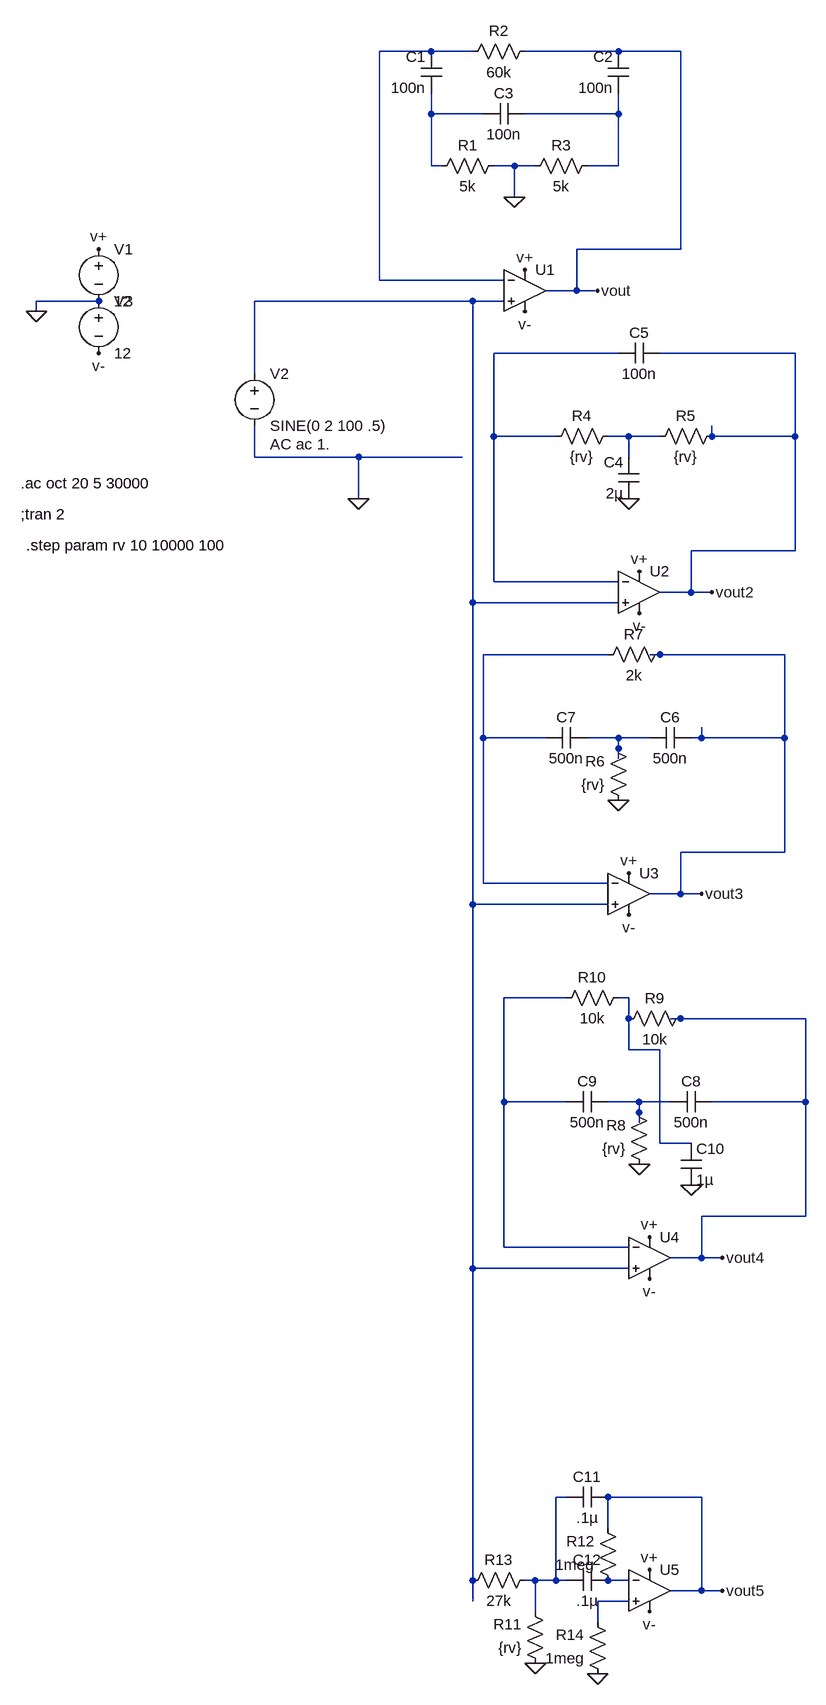
[diagram p0: schematic filter-compare.asc]
filter-compare.asc, the LTspice schematic file:
Version 4
SHEET 1 3112 2308
WIRE 560 -208 480 -208
WIRE 624 -208 560 -208
WIRE 848 -208 704 -208
WIRE 944 -208 848 -208
WIRE 560 -112 560 -144
WIRE 640 -112 560 -112
WIRE 848 -112 848 -144
WIRE 848 -112 704 -112
WIRE 560 -32 560 -112
WIRE 576 -32 560 -32
WIRE 688 -32 656 -32
WIRE 720 -32 688 -32
WIRE 848 -32 848 -112
WIRE 848 -32 800 -32
WIRE 688 16 688 -32
WIRE 944 96 944 -208
WIRE 944 96 784 96
WIRE 480 144 480 -208
WIRE 672 144 480 144
WIRE 784 160 784 96
WIRE 784 160 736 160
WIRE 816 160 784 160
WIRE 48 176 -48 176
WIRE 624 176 288 176
WIRE 672 176 624 176
WIRE -48 192 -48 176
WIRE 848 256 656 256
WIRE 1120 256 912 256
WIRE 288 288 288 176
WIRE 656 384 656 256
WIRE 752 384 656 384
WIRE 864 384 832 384
WIRE 912 384 864 384
WIRE 992 384 992 368
WIRE 1120 384 1120 256
WIRE 1120 384 992 384
WIRE 288 416 288 368
WIRE 448 416 288 416
WIRE 608 416 448 416
WIRE 864 416 864 384
WIRE 448 480 448 416
WIRE 1120 560 1120 384
WIRE 1120 560 960 560
WIRE 656 608 656 384
WIRE 848 608 656 608
WIRE 960 624 960 560
WIRE 960 624 912 624
WIRE 992 624 960 624
WIRE 624 640 624 176
WIRE 848 640 624 640
WIRE 832 720 640 720
WIRE 912 720 896 720
WIRE 1104 720 912 720
WIRE 640 848 640 720
WIRE 736 848 640 848
WIRE 848 848 800 848
WIRE 896 848 848 848
WIRE 976 848 976 832
WIRE 976 848 960 848
WIRE 1104 848 1104 720
WIRE 1104 848 976 848
WIRE 848 864 848 848
WIRE 848 880 848 864
WIRE 1104 1024 1104 848
WIRE 1104 1024 944 1024
WIRE 640 1072 640 848
WIRE 832 1072 640 1072
WIRE 944 1088 944 1024
WIRE 944 1088 896 1088
WIRE 976 1088 944 1088
WIRE 624 1104 624 640
WIRE 832 1104 624 1104
WIRE 768 1248 672 1248
WIRE 864 1248 848 1248
WIRE 864 1280 864 1248
WIRE 944 1280 928 1280
WIRE 1136 1280 944 1280
WIRE 864 1328 864 1280
WIRE 912 1328 864 1328
WIRE 672 1408 672 1248
WIRE 768 1408 672 1408
WIRE 880 1408 832 1408
WIRE 928 1408 880 1408
WIRE 1136 1408 1136 1280
WIRE 1136 1408 992 1408
WIRE 880 1424 880 1408
WIRE 880 1440 880 1424
WIRE 912 1472 912 1328
WIRE 960 1472 912 1472
WIRE 1136 1584 1136 1408
WIRE 1136 1584 976 1584
WIRE 672 1632 672 1408
WIRE 864 1632 672 1632
WIRE 976 1648 976 1584
WIRE 976 1648 928 1648
WIRE 1008 1648 976 1648
WIRE 624 1664 624 1104
WIRE 864 1664 624 1664
WIRE 768 2016 752 2016
WIRE 976 2016 832 2016
WIRE 832 2064 832 2016
WIRE 624 2144 624 1664
WIRE 720 2144 704 2144
WIRE 752 2144 752 2016
WIRE 752 2144 720 2144
WIRE 768 2144 752 2144
WIRE 864 2144 832 2144
WIRE 976 2160 976 2016
WIRE 976 2160 928 2160
WIRE 1008 2160 976 2160
WIRE 624 2176 624 2144
WIRE 864 2176 816 2176
WIRE 720 2192 720 2144
WIRE 816 2208 816 2176
FLAG 448 480 0
FLAG -48 192 0
FLAG 48 96 v+
FLAG 704 128 v+
FLAG 48 256 v-
FLAG 704 192 v-
FLAG 816 160 vout
FLAG 688 16 0
FLAG 880 592 v+
FLAG 880 656 v-
FLAG 992 624 vout2
FLAG 864 480 0
FLAG 864 1056 v+
FLAG 864 1120 v-
FLAG 976 1088 vout3
FLAG 848 944 0
FLAG 896 1616 v+
FLAG 896 1680 v-
FLAG 1008 1648 vout4
FLAG 880 1504 0
FLAG 960 1536 0
FLAG 896 2128 v+
FLAG 896 2192 v-
FLAG 1008 2160 vout5
FLAG 720 2272 0
FLAG 816 2288 0
SYMBOL voltage 48 80 R0
WINDOW 123 0 0 Left 2
WINDOW 39 0 0 Left 2
SYMATTR InstName V1
SYMATTR Value 12
SYMBOL voltage 288 272 R0
WINDOW 123 24 124 Left 2
WINDOW 39 0 0 Left 2
SYMATTR Value2 AC ac 1.
SYMATTR InstName V2
SYMATTR Value SINE(0 2 100 .5)
SYMBOL Opamps\\UniversalOpamp2 704 160 R0
SYMATTR InstName U1
SYMBOL res 672 -48 R90
WINDOW 0 0 56 VBottom 2
WINDOW 3 32 56 VTop 2
SYMATTR InstName R1
SYMATTR Value 5k
SYMBOL res 720 -224 R90
WINDOW 0 0 56 VBottom 2
WINDOW 3 32 56 VTop 2
SYMATTR InstName R2
SYMATTR Value 60k
SYMBOL cap 576 -144 R180
WINDOW 0 24 56 Left 2
WINDOW 3 24 8 Left 2
SYMATTR InstName C1
SYMATTR Value 100n
SYMBOL cap 864 -144 R180
WINDOW 0 24 56 Left 2
WINDOW 3 24 8 Left 2
SYMATTR InstName C2
SYMATTR Value 100n
SYMBOL voltage 48 160 R0
WINDOW 123 0 0 Left 2
WINDOW 39 0 0 Left 2
SYMATTR InstName V3
SYMATTR Value 12
SYMBOL res 816 -48 R90
WINDOW 0 0 56 VBottom 2
WINDOW 3 32 56 VTop 2
SYMATTR InstName R3
SYMATTR Value 5k
SYMBOL cap 704 -128 R90
WINDOW 0 0 32 VBottom 2
WINDOW 3 32 32 VTop 2
SYMATTR InstName C3
SYMATTR Value 100n
SYMBOL Opamps\\UniversalOpamp2 880 624 R0
SYMATTR InstName U2
SYMBOL res 848 368 R90
WINDOW 0 0 56 VBottom 2
WINDOW 3 32 56 VTop 2
SYMATTR InstName R4
SYMATTR Value {rv}
SYMBOL res 1008 368 R90
WINDOW 0 0 56 VBottom 2
WINDOW 3 32 56 VTop 2
SYMATTR InstName R5
SYMATTR Value {rv}
SYMBOL cap 880 480 R180
WINDOW 0 24 56 Left 2
WINDOW 3 24 8 Left 2
SYMATTR InstName C4
SYMATTR Value 2µ
SYMBOL cap 848 272 R270
WINDOW 0 32 32 VTop 2
WINDOW 3 0 32 VBottom 2
SYMATTR InstName C5
SYMATTR Value 100n
SYMBOL Opamps\\UniversalOpamp2 864 1088 R0
SYMATTR InstName U3
SYMBOL res 864 960 R180
WINDOW 0 36 76 Left 2
WINDOW 3 36 40 Left 2
SYMATTR InstName R6
SYMATTR Value {rv}
SYMBOL res 928 704 R90
WINDOW 0 0 56 VBottom 2
WINDOW 3 32 56 VTop 2
SYMATTR InstName R7
SYMATTR Value 2k
SYMBOL cap 896 864 R270
WINDOW 0 32 32 VTop 2
WINDOW 3 0 32 VBottom 2
SYMATTR InstName C6
SYMATTR Value 500n
SYMBOL cap 736 864 R270
WINDOW 0 32 32 VTop 2
WINDOW 3 0 32 VBottom 2
SYMATTR InstName C7
SYMATTR Value 500n
SYMBOL Opamps\\UniversalOpamp2 896 1648 R0
SYMATTR InstName U4
SYMBOL res 896 1520 R180
WINDOW 0 36 76 Left 2
WINDOW 3 36 40 Left 2
SYMATTR InstName R8
SYMATTR Value {rv}
SYMBOL res 960 1264 R90
WINDOW 0 0 56 VBottom 2
WINDOW 3 32 56 VTop 2
SYMATTR InstName R9
SYMATTR Value 10k
SYMBOL cap 928 1424 R270
WINDOW 0 32 32 VTop 2
WINDOW 3 0 32 VBottom 2
SYMATTR InstName C8
SYMATTR Value 500n
SYMBOL cap 768 1424 R270
WINDOW 0 32 32 VTop 2
WINDOW 3 0 32 VBottom 2
SYMATTR InstName C9
SYMATTR Value 500n
SYMBOL res 864 1232 R90
WINDOW 0 0 56 VBottom 2
WINDOW 3 32 56 VTop 2
SYMATTR InstName R10
SYMATTR Value 10k
SYMBOL cap 944 1472 R0
SYMATTR InstName C10
SYMATTR Value 1µ
SYMBOL Opamps\\UniversalOpamp2 896 2160 R0
SYMATTR InstName U5
SYMBOL res 736 2288 R180
WINDOW 0 36 76 Left 2
WINDOW 3 36 40 Left 2
SYMATTR InstName R11
SYMATTR Value {rv}
SYMBOL res 848 2160 R180
WINDOW 0 36 76 Left 2
WINDOW 3 36 40 Left 2
SYMATTR InstName R12
SYMATTR Value 1meg
SYMBOL cap 768 2032 R270
WINDOW 0 32 32 VTop 2
WINDOW 3 0 32 VBottom 2
SYMATTR InstName C11
SYMATTR Value .1µ
SYMBOL cap 768 2160 R270
WINDOW 0 32 32 VTop 2
WINDOW 3 0 32 VBottom 2
SYMATTR InstName C12
SYMATTR Value .1µ
SYMBOL res 720 2128 R90
WINDOW 0 0 56 VBottom 2
WINDOW 3 32 56 VTop 2
SYMATTR InstName R13
SYMATTR Value 27k
SYMBOL res 832 2304 R180
WINDOW 0 36 76 Left 2
WINDOW 3 36 40 Left 2
SYMATTR InstName R14
SYMATTR Value 1meg
TEXT -72 504 Left 2 !;tran 2
TEXT -72 456 Left 2 !.ac oct 20 5 30000
TEXT -64 552 Left 2 !.step param rv 10 10000 100

The netlist it stands for:
* filter-compare.asc
V1 v+ 0 12
V2 N004 0 SINE(0 2 100 .5) AC ac 1.
XU1 N004 N001 v+ v- vout level.2 Avol=1Meg GBW=10Meg Slew=10Meg ilimit=25m rail=0 Vos=0 phimargin=45 en=0 enk=0 in=0 ink=0 Rin=500Meg  ; pins IN+ IN- V+ V- OUT
R1 0 N002 5k
R2 vout N001 60k
C1 N002 N001 100n
C2 N003 vout 100n
V3 0 v- 12
R3 N003 0 5k
C3 N003 N002 100n
XU2 N004 N005 v+ v- vout2 level.2 Avol=1Meg GBW=10Meg Slew=10Meg ilimit=25m rail=0 Vos=0 phimargin=45 en=0 enk=0 in=0 ink=0 Rin=500Meg  ; pins IN+ IN- V+ V- OUT
R4 N006 N005 {rv}
R5 vout2 N006 {rv}
C4 0 N006 2µ
C5 N005 vout2 100n
XU3 N004 N007 v+ v- vout3 level.2 Avol=1Meg GBW=10Meg Slew=10Meg ilimit=25m rail=0 Vos=0 phimargin=45 en=0 enk=0 in=0 ink=0 Rin=500Meg  ; pins IN+ IN- V+ V- OUT
R6 0 N008 {rv}
R7 vout3 N007 2k
C6 N008 vout3 500n
C7 N007 N008 500n
XU4 N004 N009 v+ v- vout4 level.2 Avol=1Meg GBW=10Meg Slew=10Meg ilimit=25m rail=0 Vos=0 phimargin=45 en=0 enk=0 in=0 ink=0 Rin=500Meg  ; pins IN+ IN- V+ V- OUT
R8 0 N011 {rv}
R9 vout4 N010 10k
C8 N011 vout4 500n
C9 N009 N011 500n
R10 N010 N009 10k
C10 N010 0 1µ
XU5 N014 N013 v+ v- vout5 level.2 Avol=1Meg GBW=10Meg Slew=10Meg ilimit=25m rail=0 Vos=0 phimargin=45 en=0 enk=0 in=0 ink=0 Rin=500Meg  ; pins IN+ IN- V+ V- OUT
R11 0 N012 {rv}
R12 N013 vout5 1meg
C11 N012 vout5 .1µ
C12 N012 N013 .1µ
R13 N012 N004 27k
R14 0 N014 1meg
;tran 2
.ac oct 20 5 30000
.step param rv 10 10000 100
.lib UniversalOpamps2.sub
.backanno
.end